# Altium schematic sheet Power_Merge_Sys.SchDoc
size C
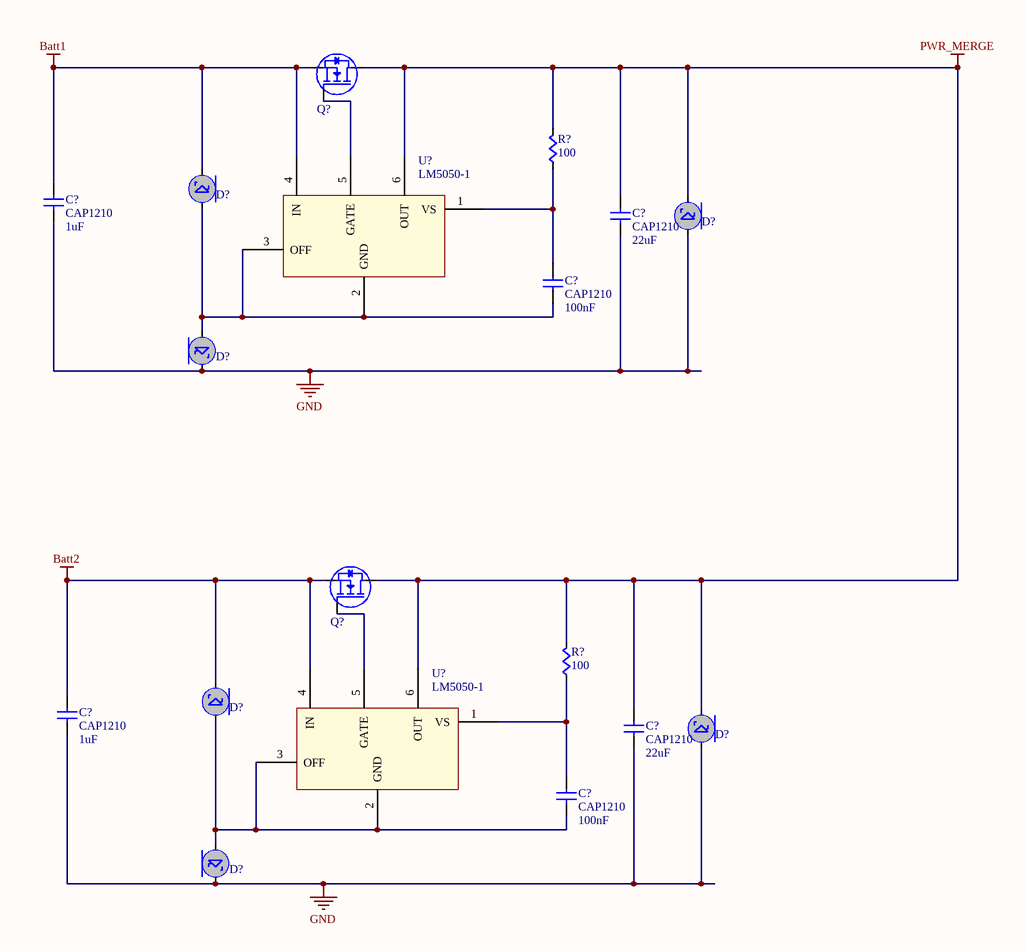
[diagram p0: Power_Merge_Sys.SchDoc]

## Parts
(Parts that share a designator on the sheet are numbered #1, #2 ... from top to bottom, then left to right.)
C?#1  CAP1210  value 1uF  [CAP1210]
C?#2  CAP1210  value 22uF  [CAP1210]
C?#3  CAP1210  value 100nF  [CAP1210]
C?#4  CAP1210  value 1uF  [CAP1210]
C?#5  CAP1210  value 22uF  [CAP1210]
C?#6  CAP1210  value 100nF  [CAP1210]
D?#1  SS16T3G  [SS16T3G]  (value not drawn)
D?#2  SMBJ60A-13-F  [SMBJ60A-13-F]  (value not drawn)
D?#3  SS16T3G  [SS16T3G]  (value not drawn)
D?#4  SS16T3G  [SS16T3G]  (value not drawn)
D?#5  SMBJ60A-13-F  [SMBJ60A-13-F]  (value not drawn)
D?#6  SS16T3G  [SS16T3G]  (value not drawn)
Q?#1  IRFB3306PbF  [TO-220AB Heatsink]  (value not drawn)
Q?#2  IRFB3306PbF  [TO-220AB Heatsink]  (value not drawn)
R?#1  value 100  [RES0603]  (hidden comment: Res)
R?#2  value 100  [RES0603]  (hidden comment: Res)
U?#1  LM5050-1  [LM5050]
U?#2  LM5050-1  [LM5050]

## Nets
Batt1: C?#1.1(A) D?#1.C Q?#1.S U?#1.4(IN)
Batt2: C?#4.1(A) D?#4.C Q?#2.S U?#2.4(IN)
GND: C?#1.2(B) C?#2.2(B) C?#4.2(B) C?#5.2(B) D?#2.A D?#3.C D?#5.A D?#6.C
PWR_MERGE: C?#2.1(A) C?#5.1(A) D?#2.C D?#5.C Q?#1.D Q?#2.D R?#1.1(A) R?#2.1(A) U?#1.6(OUT) U?#2.6(OUT)
NetC?#3_1: C?#3.1(A) R?#1.2(B) U?#1.1(VS)
NetC?#3_2: C?#3.2(B) D?#1.A D?#3.A U?#1.2(GND) U?#1.3(OFF)
NetC?#6_1: C?#6.1(A) R?#2.2(B) U?#2.1(VS)
NetC?#6_2: C?#6.2(B) D?#4.A D?#6.A U?#2.2(GND) U?#2.3(OFF)
NetQ?#1_G: Q?#1.G U?#1.5(GATE)
NetQ?#2_G: Q?#2.G U?#2.5(GATE)

## Library data of the parts
C?#1-C?#6 = CAP1210: CAP CER 10UF 50V 20% X5R 1210; Supplier 1: Digi-Key; Supplier Part Number 1: 587-2225-1-ND
D?#1 D?#3 D?#4 D?#6 = SS16T3G: DIODE SCHOTTKY 60V 1A SMA; Supplier 1: Digi-Key; Supplier Part Number 1: SS16T3GOSDKR-ND
D?#2 D?#5 = SMBJ60A-13-F: TVS UNIDIRECT 600W 60V SMB; Supplier 1: Digi-Key; Supplier Part Number 1: SMBJ60A-FDIDKR-ND
Q?#1 Q?#2 = IRFx3306PbF: HEXFET Power MOSFET; Heatsink: A10755-ND; Supplier 1: Digi-Key; Supplier Part Number 1: IRFB3306PBF-ND
U?#1 U?#2 = LM5050: High-Side OR-ing FET Controller; Supplier 1: Digi-Key; Supplier Part Number 1: LM5050MK-1/NOPBCT-ND
R?#1 R?#2 = Res: Supplier 1: Digi-Key; Supplier Part Number 1: RMCF0603JT10K0CT-ND